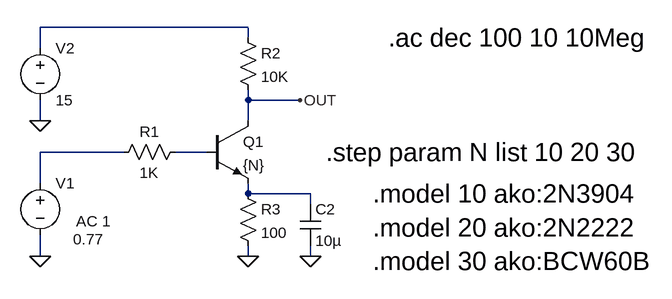
[diagram p0: schematic Fig_3-28_AKO.asc]
Fig_3-28_AKO.asc, the LTspice schematic file:
Version 4
SHEET 1 880 680
WIRE 112 -160 -208 -160
WIRE 112 -144 112 -160
WIRE -208 -128 -208 -160
WIRE 112 -48 112 -64
WIRE 192 -48 112 -48
WIRE -208 -16 -208 -48
WIRE 112 -16 112 -48
WIRE -80 32 -208 32
WIRE 48 32 0 32
WIRE -208 80 -208 32
WIRE 112 96 112 80
WIRE 208 96 112 96
WIRE 208 112 208 96
WIRE -208 192 -208 160
WIRE 112 192 112 176
WIRE 208 192 208 176
FLAG 112 192 0
FLAG -208 -16 0
FLAG -208 192 0
FLAG 192 -48 OUT
FLAG 208 192 0
SYMBOL npn 48 -16 R0
SYMATTR InstName Q1
SYMATTR Value {N}
SYMBOL voltage -208 64 R0
WINDOW 3 51 102 Left 2
WINDOW 123 55 74 Left 2
WINDOW 39 0 0 Left 2
SYMATTR Value 0.77
SYMATTR Value2 AC 1
SYMATTR InstName V1
SYMBOL voltage -208 -144 R0
WINDOW 123 0 0 Left 2
WINDOW 39 0 0 Left 2
SYMATTR InstName V2
SYMATTR Value 15
SYMBOL res -96 48 R270
WINDOW 0 32 56 VTop 2
WINDOW 3 0 56 VBottom 2
SYMATTR InstName R1
SYMATTR Value 1K
SYMBOL res 96 -160 R0
SYMATTR InstName R2
SYMATTR Value 10K
SYMBOL res 96 80 R0
SYMATTR InstName R3
SYMATTR Value 100
SYMBOL cap 192 112 R0
SYMATTR InstName C2
SYMATTR Value 10µ
TEXT 304 96 Left 4 !.model 10 ako:2N3904\n.model 20 ako:2N2222\n.model 30 ako:BCW60B
TEXT 328 -144 Left 4 !.ac dec 100 10 10Meg
TEXT 232 32 Left 4 !.step param N list 10 20 30

The netlist it stands for:
* Fig_3-28_AKO.asc
Q1 OUT N003 N004 0 {N}
V1 N002 0 0.77 AC 1
V2 N001 0 15
R1 N002 N003 1K
R2 N001 OUT 10K
R3 N004 0 100
C2 N004 0 10µ
.model NPN NPN
.model PNP PNP
.lib standard.bjt
.model 10 ako:2N3904
.model 20 ako:2N2222
.model 30 ako:BCW60B
.ac dec 100 10 10Meg
.step param N list 10 20 30
.backanno
.end